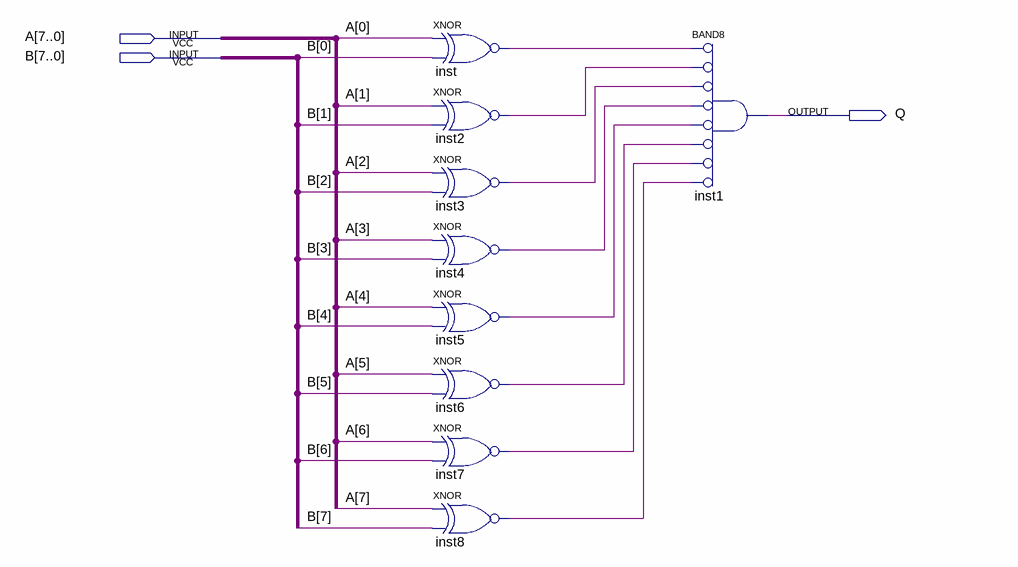
[diagram p0: schematic sheet]
// Quartus schematic equivalence_8b.bdf as structural Verilog: 9 symbols, 3 pins
module equivalence_8b (
  input  [7:0] A,
  input  [7:0] B,
  output Q
);

  wire inst2_out, inst3_out, inst4_out, inst5_out, inst6_out, inst7_out, inst8_out, inst_out;

  xnor inst (inst_out, A[0], B[0]);
  xnor inst2 (inst2_out, A[1], B[1]);
  xnor inst3 (inst3_out, A[2], B[2]);
  xnor inst4 (inst4_out, A[3], B[3]);
  xnor inst5 (inst5_out, A[4], B[4]);
  xnor inst6 (inst6_out, A[5], B[5]);
  xnor inst7 (inst7_out, A[6], B[6]);
  xnor inst8 (inst8_out, A[7], B[7]);
  and inst1 (Q, ~inst_out, ~inst2_out, ~inst3_out, ~inst4_out, ~inst5_out, ~inst6_out, ~inst7_out, ~inst8_out);  // BAND8
endmodule
